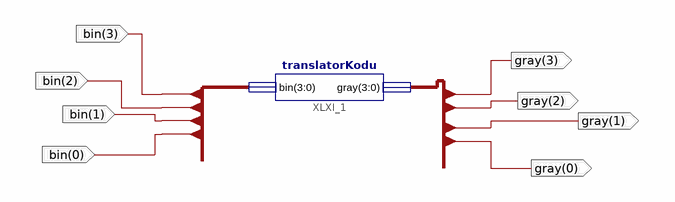
[diagram p0: schematic sheet 1]
// Xilinx ISE schematic translatorSchemat.sch (xc9500xl) as structural Verilog: 1 symbols, 8 ports
module translatorSchemat (
  input  [3:0] bin,
  output [3:0] gray
);

  translatorKodu XLXI_1 (.bin(bin), .gray(gray));
endmodule
